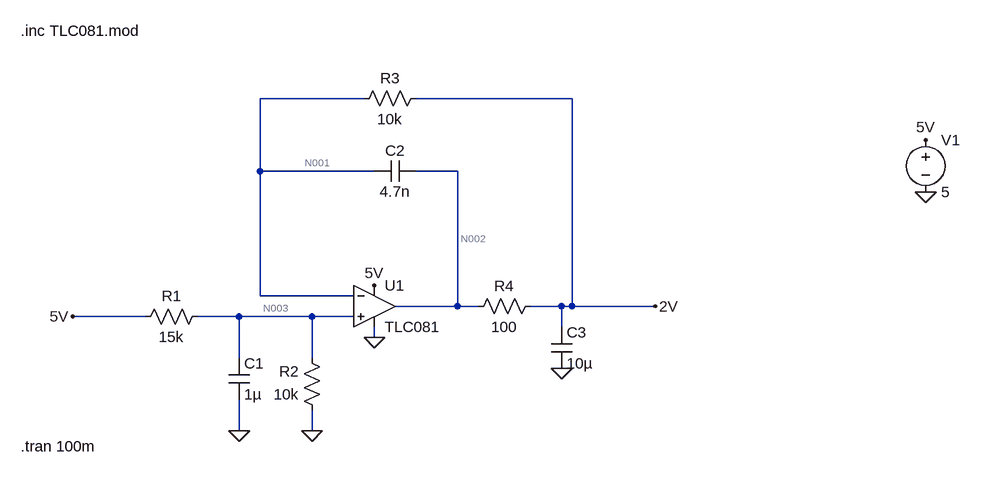
[diagram p0: schematic Draft1.asc]
Draft1.asc, the LTspice schematic file:
Version 4.1
SHEET 1 1692 680
WIRE 448 -128 288 -128
WIRE 768 -128 528 -128
WIRE 288 -16 288 -128
WIRE 464 -16 288 -16
WIRE 592 -16 528 -16
WIRE 288 176 288 -16
WIRE 432 176 288 176
WIRE 592 192 592 -16
WIRE 592 192 496 192
WIRE 624 192 592 192
WIRE 752 192 704 192
WIRE 768 192 768 -128
WIRE 768 192 752 192
WIRE 896 192 768 192
WIRE 112 208 0 208
WIRE 256 208 192 208
WIRE 368 208 256 208
WIRE 432 208 368 208
WIRE 752 224 752 192
WIRE 464 240 464 224
WIRE 256 272 256 208
WIRE 368 272 368 208
WIRE 256 384 256 336
WIRE 368 384 368 352
FLAG 464 160 5V
FLAG 464 240 0
FLAG 256 384 0
FLAG 368 384 0
FLAG 752 288 0
FLAG 0 208 5V
FLAG 896 192 2V
FLAG 1312 16 0
FLAG 1312 -64 5V
SYMBOL OpAmps\\opamp2 464 128 R0
SYMATTR InstName U1
SYMATTR Value TLC081
SYMBOL res 208 192 R90
WINDOW 0 0 56 VBottom 2
WINDOW 3 32 56 VTop 2
SYMATTR InstName R1
SYMATTR Value 15k
SYMBOL res 384 368 R180
WINDOW 0 36 76 Left 2
WINDOW 3 36 40 Left 2
SYMATTR InstName R2
SYMATTR Value 10k
SYMBOL cap 240 272 R0
SYMATTR InstName C1
SYMATTR Value 1µ
SYMBOL cap 528 -32 R90
WINDOW 0 0 32 VBottom 2
WINDOW 3 32 32 VTop 2
SYMATTR InstName C2
SYMATTR Value 4.7n
SYMBOL res 544 -144 R90
WINDOW 0 0 56 VBottom 2
WINDOW 3 32 56 VTop 2
SYMATTR InstName R3
SYMATTR Value 10k
SYMBOL res 720 176 R90
WINDOW 0 0 56 VBottom 2
WINDOW 3 32 56 VTop 2
SYMATTR InstName R4
SYMATTR Value 100
SYMBOL cap 736 224 R0
SYMATTR InstName C3
SYMATTR Value 10µ
SYMBOL voltage 1312 -80 R0
WINDOW 123 0 0 Left 0
WINDOW 39 0 0 Left 0
SYMATTR InstName V1
SYMATTR Value 5
TEXT -80 -232 Left 2 !.inc TLC081.mod
TEXT -80 408 Left 2 !.tran 100m

The netlist it stands for:
* Draft1.asc
X§U1 N003 N001 5V 0 N002 TLC081  ; pins In+ In- V+ V- OUT
R1 N003 5V 15k
R2 0 N003 10k
C1 N003 0 1µ
C2 N002 N001 4.7n
R3 2V N001 10k
R4 2V N002 100
C3 2V 0 10µ
V1 5V 0 5
.inc TLC081.mod
.tran 100m
.backanno
.end

* Results of the author's LTspice run, read from the files saved beside the schematic
* Operating Point, zero values left out:
*   V(2v) = 2.001 V
*   V(5v) = 5 V
*   V(n001) = 2.001 V
*   V(n002) = 2.001 V
*   V(n003) = 2 V
*   I(R1) = -200 µA
*   I(R2) = -200 µA
*   I(R3) = 2.633 pA
*   I(R4) = -2.633 pA
*   I(V1) = -1.156 mA
*   Ix(u1:1) = 2.63 pA
*   Ix(u1:2) = 2.633 pA
*   Ix(u1:3) = 955.7 µA
*   Ix(u1:4) = -956.6 µA
*   Ix(u1:5) = -2.945 pA